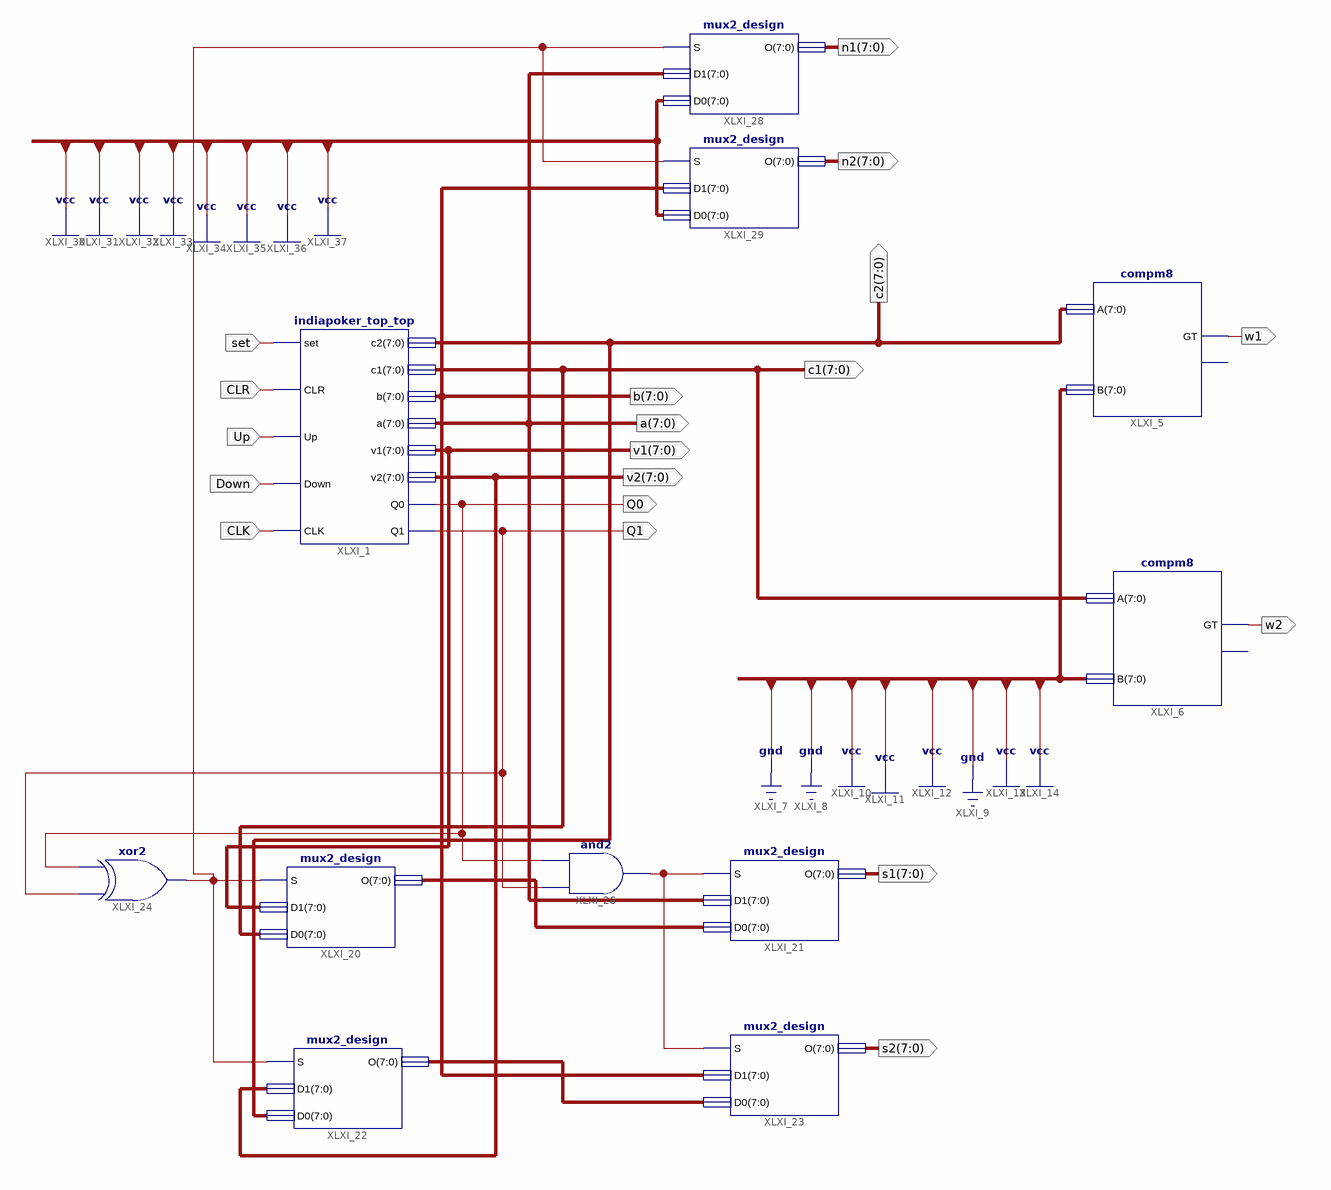
[diagram p0: schematic sheet 1]
// Xilinx ISE schematic indianpoker_top_top_top.sch (spartan3) as structural Verilog: 11 symbols, 19 ports
module indianpoker_top_top_top (
  input  set,
  input  CLR,
  input  Up,
  input  Down,
  input  CLK,
  output [7:0] c2,
  output [7:0] c1,
  output Q1,
  output Q0,
  output [7:0] a,
  output [7:0] b,
  output [7:0] v1,
  output [7:0] v2,
  output [7:0] n1,
  output [7:0] n2,
  output [7:0] s1,
  output [7:0] s2,
  output w1,
  output w2
);

  wire XLXN_43, XLXN_54;
  wire [7:0] XLXN_44, XLXN_45;

  indiapoker_top_top XLXI_1 (
    .set(set), .CLR(CLR), .Up(Up), .Down(Down), .CLK(CLK), .c2(c2), .c1(c1), .v1(v1), .v2(v2), .Q0(Q0),
    .Q1(Q1), .b(b), .a(a));
  compm8 XLXI_5 (.A(c2), .B(8'b00111011), .GT(w1));  // open: LT
  compm8 XLXI_6 (.A(c1), .B(8'b00111011), .GT(w2));  // open: LT
  mux2_design XLXI_20 (.S(XLXN_54), .D1(v1), .D0(c1), .O(XLXN_44));
  mux2_design XLXI_21 (.S(XLXN_43), .D1(a), .D0(XLXN_44), .O(s1));
  mux2_design XLXI_22 (.S(XLXN_54), .D1(v2), .D0(c2), .O(XLXN_45));
  mux2_design XLXI_23 (.S(XLXN_43), .D1(b), .D0(XLXN_45), .O(s2));
  xor XLXI_24 (XLXN_54, Q1, Q0);
  and XLXI_26 (XLXN_43, Q1, Q0);
  mux2_design XLXI_28 (.S(XLXN_54), .D1(a), .D0({8{1'b1}}), .O(n1));
  mux2_design XLXI_29 (.S(XLXN_54), .D1(b), .D0({8{1'b1}}), .O(n2));
endmodule
